# EAGLE design LED_DIMMER (EAGLE 7.6.0)
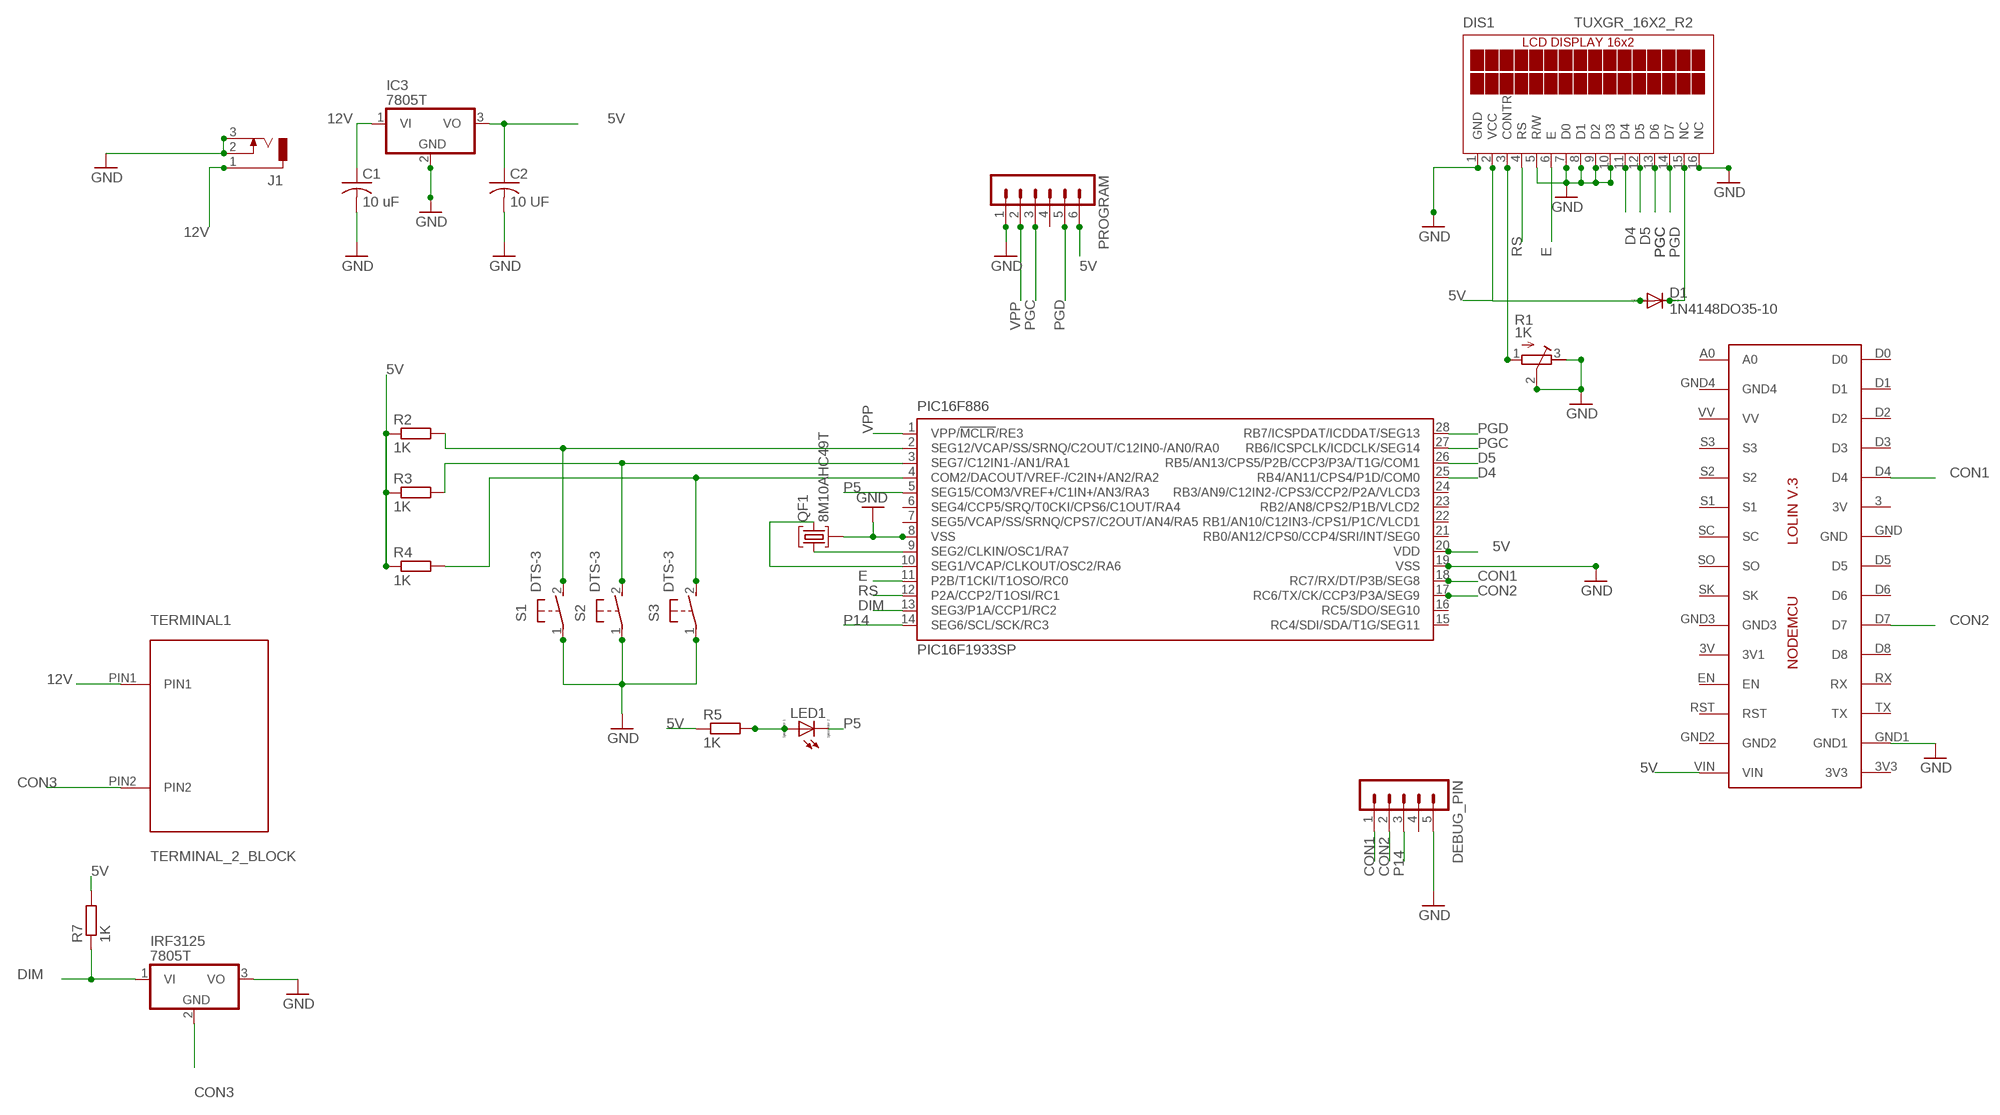
[diagram p0: schematic, sheet 1]

## Parts
C1  10 uF  C-US025-025X050  [C025-025X050]
C2  10 UF  C-US025-025X050  [C025-025X050]
D1  1N4148DO35-10  [DO35-10]
DEBUG_PIN  MA05-1  [MA05-1]
DIS1  TUXGR_16X2_R2  [TUXGR_16X2_R2]
IC2  LOLINV3  [LOLINV3]
IC3  7805T  [TO220H]
IRF3125  7805T  [TO220H]
J1  DCJ0303  [DCJ0303]
LED1  LED_ELD260  [LED_LD260]
PIC16F886  PIC16F1933SP  [DIL28-3]
PROGRAM  MA06-1  [MA06-1]
QF1  8M10AHC49T  [HC49U]
R1  1K  R-TRIMM64W  [RTRIM64W]
R2  1K  R-EU_0204/7  [0204/7]
R3  1K  R-EU_0204/7  [0204/7]
R4  1K  R-EU_0204/7  [0204/7]
R5  1K  R-EU_0204/7  [0204/7]
R7  1K  R-EU_0204/7  [0204/7]
S1  DTS-3  [DTS-3]
S2  DTS-3  [DTS-3]
S3  DTS-3  [DTS-3]
TERMINAL1  TERMINAL_2_BLOCK  [TERMINAL_2_BLOCK]

## Nets
5V: C2.1 D1.A DIS1.2(VCC) IC2.VIN IC3.3(VO) PIC16F886.20(VDD) PROGRAM.6 R2.1 R3.1 R4.1 R5.1 R7.2
12V: C1.1 IC3.1(VI) J1.1 TERMINAL1.PIN1
CON1: DEBUG_PIN.1 IC2.D4 PIC16F886.18(RC7/RX/DT/P3B/SEG8)
CON2: DEBUG_PIN.2 IC2.D7 PIC16F886.17(RC6/TX/CK/CCP3/P3A/SEG9)
CON3: IRF3125.2(GND) TERMINAL1.PIN2
D4: DIS1.11(D4) PIC16F886.25(RB4/AN11/CPS4/P1D/COM0)
D5: DIS1.12(D5) PIC16F886.26(RB5/AN13/CPS5/P2B/CCP3/P3A/T1G/COM1)
DIM: IRF3125.1(VI) PIC16F886.13(SEG3/P1A/CCP1/RC2) R7.1
E: DIS1.6(E) PIC16F886.11(P2B/T1CKI/T1OSO/RC0)
GND: C1.2 C2.2 DEBUG_PIN.5 DIS1.1(GND) DIS1.5(R/W) DIS1.7(D0) DIS1.8(D1) DIS1.9(D2) DIS1.10(D3) DIS1.16(NC) IC2.GND1 IC3.2(GND) IRF3125.3(VO) J1.2 J1.3 PIC16F886.8(VSS) PIC16F886.19(VSS) PROGRAM.1 QF1.2 R1.2(S) R1.3(E) S1.1 S2.1 S3.1
N$1: PIC16F886.2(SEG12/VCAP/SS/SRNQ/C2OUT/C12IN0-/AN0/RA0) R2.2 S1.2
N$2: PIC16F886.9(SEG2/CLKIN/OSC1/RA7) QF1.1
N$3: PIC16F886.10(SEG1/VCAP/CLKOUT/OSC2/RA6) QF1.3
N$4: PIC16F886.3(SEG7/C12IN1-/AN1/RA1) R3.2 S2.2
N$5: PIC16F886.4(COM2/DACOUT/VREF-/C2IN+/AN2/RA2) R4.2 S3.2
N$7: D1.C DIS1.15(NC)
N$8: DIS1.3(CONTR) R1.1(A)
N$9: LED1.A R5.2
P5: LED1.K(C) PIC16F886.5(SEG15/COM3/VREF+/C1IN+/AN3/RA3)
P14: DEBUG_PIN.3 PIC16F886.14(SEG6/SCL/SCK/RC3)
PGC: DIS1.13(D6) PIC16F886.27(RB6/ICSPCLK/ICDCLK/SEG14) PROGRAM.3
PGD: DIS1.14(D7) PIC16F886.28(RB7/ICSPDAT/ICDDAT/SEG13) PROGRAM.5
RS: DIS1.4(RS) PIC16F886.12(P2A/CCP2/T1OSI/RC1)
VPP: PIC16F886.1(VPP/!MCLR!/RE3) PROGRAM.2
Unconnected: DEBUG_PIN.4 IC2.3(3V) IC2.3V3 IC2.3V(3V1) IC2.A0 IC2.D0 IC2.D1 IC2.D2 IC2.D3 IC2.D5 IC2.D6 IC2.D8 IC2.EN IC2.GND IC2.GND2 IC2.GND3 IC2.GND4 IC2.RST IC2.RX IC2.S1 IC2.S2 IC2.S3 IC2.SC IC2.SK IC2.SO IC2.TX IC2.VV PIC16F886.6(SEG4/CCP5/SRQ/T0CKI/CPS6/C1OUT/RA4) PIC16F886.7(SEG5/VCAP/SS/SRNQ/CPS7/C2OUT/AN4/RA5) PIC16F886.15(RC4/SDI/SDA/T1G/SEG11) PIC16F886.16(RC5/SDO/SEG10) PIC16F886.21(RB0/AN12/CPS0/CCP4/SRI/INT/SEG0) PIC16F886.22(RB1/AN10/C12IN3-/CPS1/P1C/VLCD1) PIC16F886.23(RB2/AN8/CPS2/P1B/VLCD2) PIC16F886.24(RB3/AN9/C12IN2-/CPS3/CCP2/P2A/VLCD3) PROGRAM.4

## Library data of the parts
C1 C2 = resistor:C-US: CAPACITOR, American symbol
D1 = diode:1N4148: DIODE high speed (Philips)
DEBUG_PIN = con-lstb:MA05-1: PIN HEADER; OC_FARNELL: unknown; OC_NEWARK: unknown
DIS1 = display-lcd:TUXGR_16X2_R2: Tuxgraphics LCD display 16x2 characters reflective, without background light Source: tuxgr_12x2_r2.pdf; OC_FARNELL: unknown; OC_NEWARK: unknown
IC2 = Lolin:LOLINV3
IC3 IRF3125 = linear:78*: Positive VOLTAGE REGULATOR Source: http://cache.national.com/ds/LM/LM78L05.pdf http://www.fairchildsemi.com/ds/LM/LM7805.pdf
J1 = con-jack:DCJ0303: DC POWER JACK Source: DCJ0303.pdf; OC_FARNELL: unknown; OC_NEWARK: unknown
LED1 = eagle-ltspice:LED_E: LED Source: http://www.osram.convergy.de Source: www.luxeon.com Source: www.kingbright.com; SPICEMODEL: NONE; SPICEPREFIX: D; SPICETYPE: diode
PIC16F886 = microchip:PIC16F19*: Flash-Based, 8-Bit CMOS Microcontrollers wtih LCD Driver and nanoWatt XLP Technology Auto generated by make-symbol-device-package-bsdl.ulp Rev. 33 Source: http://ww1.microchip.com/downloads/en/DeviceDoc/41364D.pdf; MPN: PIC16F1933-I/SP; OC_FARNELL: 1755814; OC_NEWARK: 08R1938
PROGRAM = con-lstb:MA06-1: PIN HEADER; OC_FARNELL: unknown; OC_NEWARK: unknown
QF1 = crystal:8M10AHC49T: Monolithic Crystal Filters Source: www.vanlong.com; OC_FARNELL: unknown; OC_NEWARK: unknown
R1 = resistor:R-TRIMM: Trimm resistor
R2-R5 R7 = resistor:R-EU_: RESISTOR, European symbol
S1-S3 = switch-tact:DTS-3
TERMINAL1 = Terminal_2_Block:TERMINAL_2_BLOCK

## Board
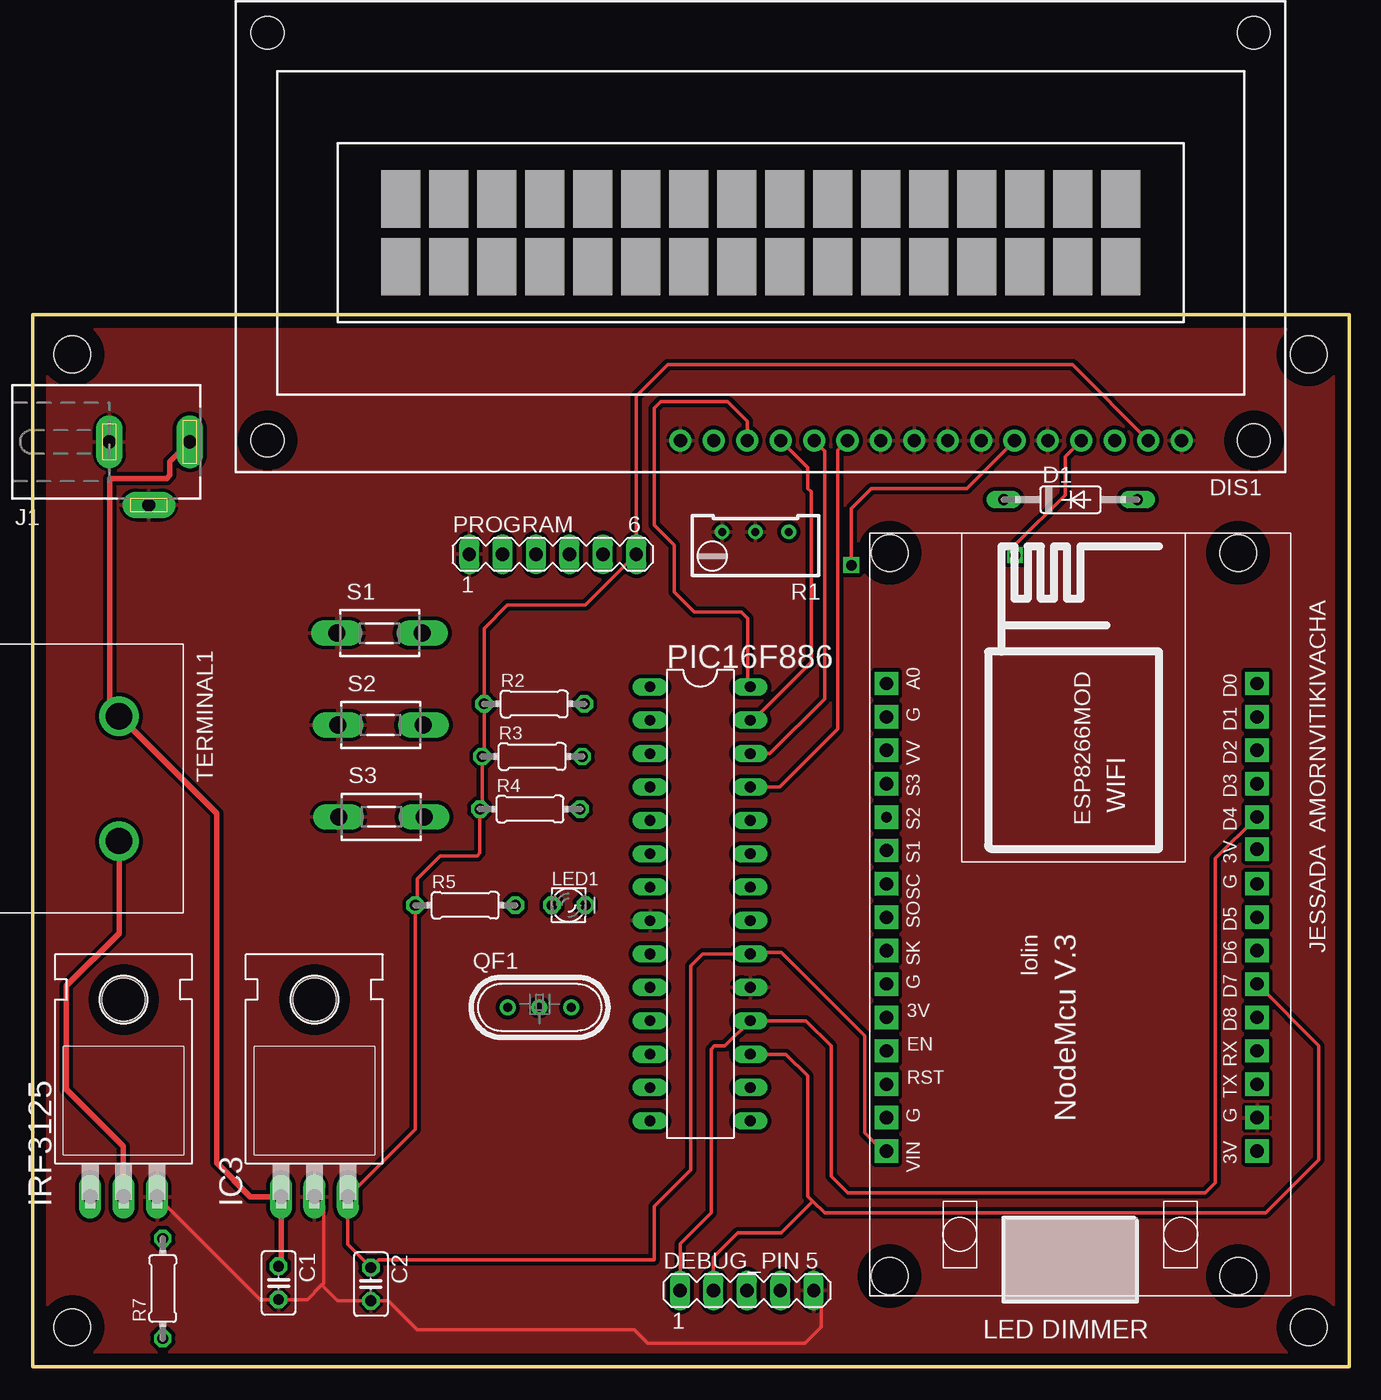
[diagram p1: board, top side]
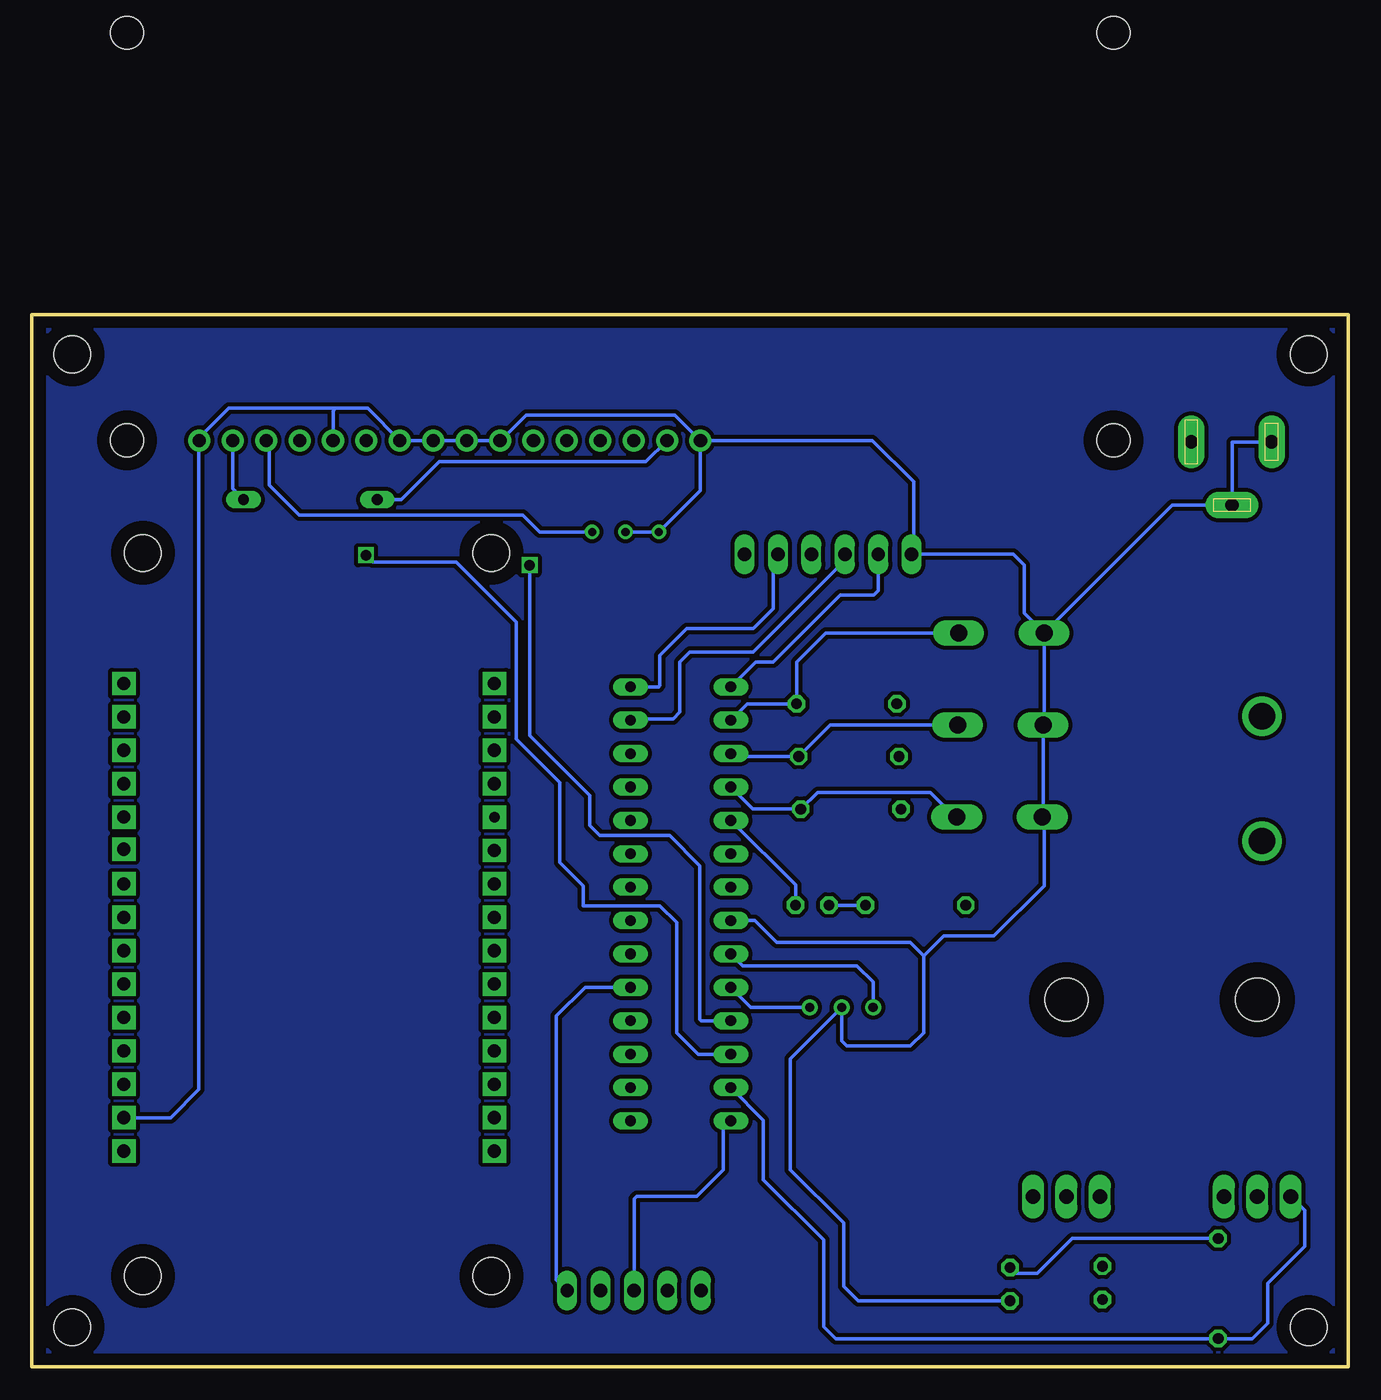
[diagram p2: board, bottom side, seen from below]

Size 100 x 80 mm. Coordinates in mm from the lower left corner, seen from the top.
Outline: 0,0 100,0 100,80 0,80 0,0
Copper layers (1*16): Top 0.035mm / dielectric 1.5mm / Bottom 0.035mm
Design rules "default": minimum track width 10mil, minimum drill 24mil, track to track 8mil, track to pad 8mil, pad to pad 8mil, via to via 8mil, smd to smd 8mil, copper to edge 40mil, drill to drill 8mil, minimum pad ring 10mil, minimum via ring 8mil, stop-mask expansion 4mil, vias tented up to drill 0mil, thermal gap 10mil
Holes 2.8 mm at 3,3 97,3 97,77 3,77
Milling: 4 lines

### Footprints (pad centres in the part's own frame; a part is rotated, then mirrored left to right if it is on the bottom)
C025-025X050 = drill 0.813 octagon: 1 -1.27,0; 2 1.27,0
DO35-10 = drill 0.813 long: A 5.08,0; C -5.08,0
MA05-1 = drill 1.016 long: 1 -5.08,0; 2 -2.54,0; 3 0,0; 4 2.54,0; 5 5.08,0
TUXGR_16X2_R2 = drill 1 pad 1.676: 1 -32,15.5; 2 -29.46,15.5; 3 -26.92,15.5; 4 -24.38,15.5; 5 -21.84,15.5; 6 -19.3,15.5; 7 -16.76,15.5; 8 -14.22,15.5; 9 -11.68,15.5; 10 -9.14,15.5; 11 -6.6,15.5; 12 -4.06,15.5; 13 -1.52,15.5; 14 1.02,15.5; 15 3.56,15.5; 16 6.1,15.5 | hole 2.5: -37.5,-15.5; 37.5,-15.5; -37.5,15.5; 37.5,15.5
LOLINV3 = drill 1 pad 1.778 square: 3 24.03,29.44; 3V 46.99,29.44; 3V3 36.83,1.27; A0 11.43,1.27; D0 11.43,29.44; D1 13.97,29.44; D2 16.51,29.44; D3 19.05,29.44; D4 21.59,29.44; D5 29.21,29.44; D6 31.75,29.44; D7 34.29,29.44; D8 36.83,29.44; EN 39.37,1.27; GND 26.67,29.44; GND1 44.45,29.44; GND2 44.45,1.27; GND3 34.29,1.27; GND4 13.97,1.27; RST 41.91,1.27; RX 39.37,29.44; S1 24.13,1.27; S3 19.05,1.27; SC 26.67,1.27; SK 31.75,1.27; SO 29.21,1.27; TX 41.91,29.44; VIN 46.99,1.27; VV 16.51,1.27 | drill 0.8 pad 1.778 square: S2 21.59,1.27 | hole 2.8: 56.5,28; 56.5,1.5; 1.5,1.5; 1.5,28
TO220H = drill 1.118 long: 1 -2.54,-10.16; 2 0,-10.16; 3 2.54,-10.16 | hole 3.302: 0,4.826
DCJ0303 = drill 1 pad 2 long: 1 0,3.1; 2 4.8,0; 3 0,-3
LED_LD260 = drill 0.813 octagon: A -1.27,0; K 1.27,0
DIL28-3 = drill 0.813 long: 1 -16.51,-3.81; 2 -13.97,-3.81; 3 -11.43,-3.81; 4 -8.89,-3.81; 5 -6.35,-3.81; 6 -3.81,-3.81; 7 -1.27,-3.81; 8 1.27,-3.81; 9 3.81,-3.81; 10 6.35,-3.81; 11 8.89,-3.81; 12 11.43,-3.81; 13 13.97,-3.81; 14 16.51,-3.81; 15 16.51,3.81; 16 13.97,3.81; 17 11.43,3.81; 18 8.89,3.81; 19 6.35,3.81; 20 3.81,3.81; 21 1.27,3.81; 22 -1.27,3.81; 23 -3.81,3.81; 24 -6.35,3.81; 25 -8.89,3.81; 26 -11.43,3.81; 27 -13.97,3.81; 28 -16.51,3.81
MA06-1 = drill 1.016 long: 1 -6.35,0; 2 -3.81,0; 3 -1.27,0; 4 1.27,0; 5 3.81,0; 6 6.35,0
HC49U = drill 0.7 pad 1.2: 1 -2.413,0; 2 -0.027,0; 3 2.413,0
RTRIM64W = drill 0.61: 1 1.27,-2.54; 2 1.27,0; 3 1.27,2.54
0204/7 = drill 0.813 octagon: 1 -3.81,0; 2 3.81,0
DTS-3 = drill 1.3 long: 1 -3.25,0; 2 3.25,0
TERMINAL_2_BLOCK = drill 2: PIN1 5.5,-4.87; PIN2 15,-4.87

### Placement (x,y rotation side)
C1  18.68,6.37 270 top
C2  25.7,6.27 270 top
D1  78.9,65.95 0 top
DEBUG_PIN  54.29,5.79 0 top
DIS1  55.34,85.95 180 top
IC2  63.64,63.39 270 top
IC3  21.41,23.09 0 top
IRF3125  6.9,23.09 0 top
J1  8.82,70.34 270 top
LED1  40.74,35.11 0 top
PIC16F886  50.74,35.2 270 top
PROGRAM  39.53,61.79 0 top
QF1  38.53,27.33 0 top
R1  54.94,62.22 90 top
R2  38.12,50.41 0 top
R3  37.96,46.41 0 top
R4  37.8,42.41 0 top
R5  32.88,35.09 0 top
R7  9.88,5.94 90 top
S1  26.36,55.79 0 top
S2  26.44,48.81 0 top
S3  26.5,41.82 0 top
TERMINAL1  11.42,54.98 270 top

### Tracks (layer width: path | path; a pad name or v marks a point on that pad's centre or on a via)
5V
  Top 0.254: IC2.VIN 64.63,16.4 63.25,17.78 63.25,25.15 56.9,31.5 54.66,31.5 PIC16F886.20 50.95,31.39 50.04,30.48 50.04,14.99 47.24,12.19 47.24,8.13 26.28,8.13 C2.1 23.95,9.29 IC3.3 29.07,18.05 R5.1 29.21,35.24 29.21,37.08 30.99,38.86 33.78,38.86 33.99,39.07 R4.1 34.15,42.57 R3.1 34.31,46.57 R2.1 34.31,56.15 36.07,57.91 42,57.91 PROGRAM.6 45.88,73.82 48.26,76.2 79.05,76.2 DIS1.2
  Bottom 0.254: DIS1.2 84.8,66.77 D1.A | R7.2 20.98,9.75 23.62,7.11 25.27,7.11 C2.1
12V
  Top 0.406: J1.1 10.41,68.83 10.41,67.82 10.16,67.56 5.84,67.56 5.84,50.8 6.55,50.09 TERMINAL1.PIN1 13.97,42.06 13.97,15.49 16.53,12.93 IC3.1 18.87,7.83 C1.1
CON1
  Top 0.254: IC2.D4 89.92,38.64 89.92,13.97 89.15,13.21 61.98,13.21 60.71,14.48 60.71,24.38 58.78,26.31 PIC16F886.18 52.62,24.38 51.82,24.38 51.56,24.13 51.56,11.68 49.21,9.33 DEBUG_PIN.1
CON2
  Top 0.254: PIC16F886.17 57.26,23.77 58.93,22.1 58.93,12.95 59.31,12.57 | 59.31,12.57 60.2,11.68 93.73,11.68 97.79,15.75 97.79,24.39 IC2.D7 | DEBUG_PIN.2 51.75,8.32 53.59,10.16 56.9,10.16 59.31,12.57
CON3
  Top 0.406: TERMINAL1.PIN2 6.55,32.97 2.54,28.96 2.54,21.08 6.86,16.76 6.86,12.97 IRF3125.2
D4
  Top 0.254: PIC16F886.25 56.79,44.09 61.21,48.51 61.21,69.72 DIS1.11
D5
  Top 0.254: PIC16F886.26 56.03,46.63 60.2,50.8 60.2,69.65 DIS1.12
DIM
  Bottom 0.254: IRF3125.1 3.3,11.87 3.3,9.14 6.1,6.35 6.1,3.3 7.27,2.13 R7.1 38.96,2.13 39.88,3.05 39.88,9.65 44.45,14.22 44.45,18.75 PIC16F886.13
E  (via drill 0.8 pad 0.25)
  Top 0.254: v62.23,60.96 62.23,65.28 63.75,66.8 70.99,66.8 DIS1.6
  Bottom 0.254: PIC16F886.11 49.17,26.31 49.28,26.42 49.28,38.1 51.56,40.39 56.9,40.39 57.66,41.15 57.66,43.43 62.23,48.01 v62.23,60.96
GND
  Top 0.254: IRF3125.3 17.27,5.1 C1.2 20.85,5.1 21.97,6.22 | 21.97,6.22 22.1,6.35 22.1,12.24 IC3.2 | DEBUG_PIN.5 59.94,5.22 59.94,3.05 58.67,1.78 46.74,1.78 45.72,2.79 29.21,2.79 27,5 C2.2 23.19,5 21.97,6.22
  Bottom 0.254: J1.3 8.82,70.34 J1.2 13.36,65.54 S1.1 | S1.1 23.11,48.88 S2.1 23.19,41.88 S3.1 23.11,41.69 23.11,36.58 26.92,32.77 30.73,32.77 32.26,31.24 | DIS1.16 36.16,70.45 33.02,67.31 33.02,61.95 PROGRAM.1 25.47,61.79 24.64,60.96 24.64,57.32 S1.1 | DIS1.16 49.24,66.65 R1.3 R1.2 | DIS1.16 51.18,72.39 62.48,72.39 64.42,70.45 DIS1.10 DIS1.9 DIS1.8 DIS1.7 74.55,72.9 76.96,72.9 | 76.96,72.9 85.09,72.9 87.34,70.65 DIS1.1 87.38,70.41 87.38,21.08 89.52,18.94 IC2.GND1 | DIS1.5 77.18,72.68 76.96,72.9 | PIC16F886.19 58.02,28.85 60.2,26.67 60.2,6.62 DEBUG_PIN.5 | C2.2 37.26,5 38.35,6.1 38.35,10.92 42.42,14.99 42.42,23.41 QF1.2 38.5,24.78 38.1,24.38 33.27,24.38 32.26,25.4 32.26,31.24 | PIC16F886.8 45.11,33.93 43.43,32.26 33.27,32.26 32.26,31.24
  pour Top (isolate 0.305): 0,80.01 100.08,80.01 100.08,0 0,0
N$1
  Bottom 0.254: S1.2 39.71,55.79 41.91,53.59 41.91,50.43 R2.2 45.69,50.41 PIC16F886.2
N$2
  Bottom 0.254: QF1.1 36.11,29.25 37.34,30.48 46.02,30.48 PIC16F886.9
N$3
  Bottom 0.254: QF1.3 45.41,27.33 PIC16F886.10
N$4
  Bottom 0.254: PIC16F886.3 46.71,46.41 R3.2 39.37,48.81 S2.2
N$5
  Bottom 0.254: PIC16F886.4 45.25,42.41 R4.2 40.33,43.69 31.75,43.69 29.88,41.82 S3.2
N$7
  Bottom 0.254: D1.C 71.97,65.95 69.09,68.83 53.4,68.83 DIS1.15
N$8
  Bottom 0.254: R1.1 61.46,63.49 62.74,64.77 79.76,64.77 82.04,67.06 82.04,70.23 DIS1.3
N$9
  Bottom 0.254: R5.2 39.45,35.09 LED1.A
P5
  Bottom 0.254: LED1.K 42.01,36.63 PIC16F886.5
P14
  Bottom 0.254: DEBUG_PIN.3 54.29,12.77 54.1,12.95 49.53,12.95 47.5,14.99 47.5,18.12 PIC16F886.14
PGC
  Top 0.254: PIC16F886.27 54.76,49.17 59.18,53.59 59.18,66.55 58.93,66.8 58.93,68.38 DIS1.13
  Bottom 0.254: PROGRAM.3 38.26,61.31 45.21,54.36 50.04,54.36 50.8,53.59 50.8,49.78 51.31,49.28 54.44,49.28 PIC16F886.27
PGD
  Top 0.254: DIS1.14 54.32,71.92 52.83,73.41 47.75,73.41 47.24,72.9 47.24,64.01 48.77,62.48 48.77,58.93 50.29,57.4 53.85,57.4 54.36,56.9 54.36,51.9 PIC16F886.28
  Bottom 0.254: PIC16F886.28 52.43,51.71 52.32,51.82 52.32,54.1 50.29,56.13 45.21,56.13 43.69,57.66 43.69,61.44 PROGRAM.5
RS  (via drill 0.8 pad 0.25)
  Top 0.254: v74.68,61.72 74.68,62.48 78.49,66.29 78.49,69.22 DIS1.4
  Bottom 0.254: PIC16F886.12 49.42,23.77 51.05,25.4 51.05,33.78 52.32,35.05 58.17,35.05 58.17,36.58 59.94,38.35 59.94,44.45 63.25,47.75 63.25,56.64 67.82,61.21 74.17,61.21 v74.68,61.72
VCC
  pour Bottom (isolate 0.305): 0,80.01 100.08,80.01 100.08,0 0,0
VPP
  Bottom 0.254: PROGRAM.2 35.72,59.02 36.07,58.67 38.61,58.67 43.69,53.59 45.05,53.59 PIC16F886.1

### Text on the board
tNames: JESSADA AMORNVITIKIVACHA | LED DIMMER